# Altium schematic sheet SHDN-S03-V00-ShutdownSegment.SchDoc: Shutdown Segment
size A3; DrawnBy: Jonn Dillon; DocumentNumber: 3; SheetNumber: 3; SheetTotal: 11
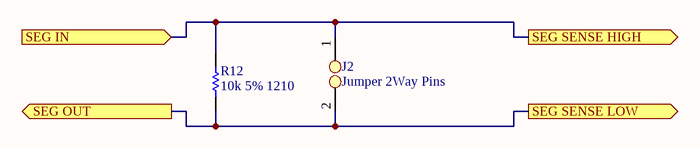
[diagram p0: SHDN-S03-V00-ShutdownSegment.SchDoc]

## Parts
J2  Jumper 2Way Pins  [Jumper_2Way_Pin]
R12  10k 5% 1210  [Res_ThinFilm_1210]

## Ports
SEG IN (in), SEG OUT (out), SEG SENSE HIGH (out), SEG SENSE LOW (out)

## Nets
SEG IN: J2.1 R12.2 ; port SEG IN, port SEG SENSE HIGH
SEG OUT: J2.2 R12.1 ; port SEG OUT, port SEG SENSE LOW

## Notes on the sheet
- Revision History:
- Sheet Title:
- Rev
- Date
- Description
- Project:
- Size:
- Drawn By:
- A3
- Number:
- Revision:
- Sheet
- Version:
- of
- QUT Motorsport
- O-120, Gardens Point
- 2 George Street
- Brisbane, QLD 4000
- Australia
- Print Date:
- Print Time:
- File Name:

## Library data of the parts
J2 = Jumper 2Way Vert Pins
R12 = 10k 5% 1210: Resistor, SMD, 10k, 1W, 5%, 1210